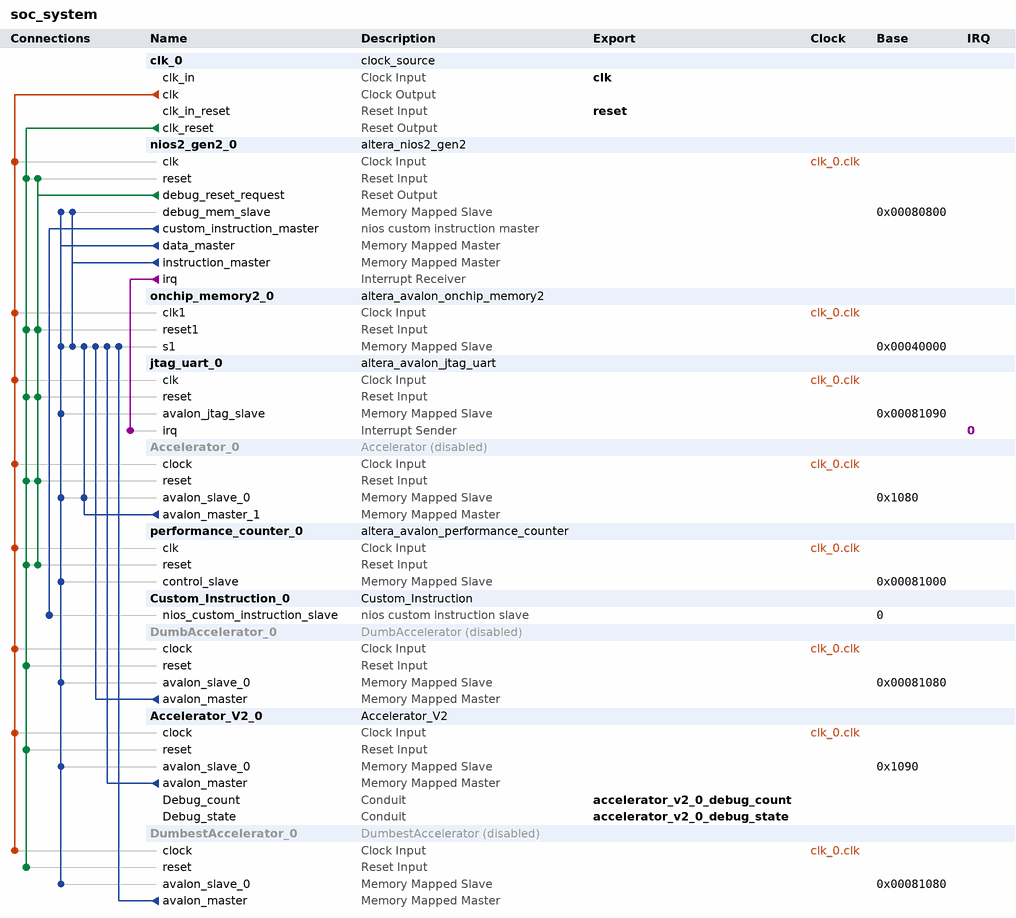
[diagram p0: system contents]
# Platform Designer (Qsys) system soc_system, Cyclone V 5CSEMA5F31C6
# Parameters at their usual value, and those the tool derives, are not listed.
package require -exact qsys 18.1
create_system soc_system
set_project_property DEVICE_FAMILY {Cyclone V}
set_project_property DEVICE 5CSEMA5F31C6

add_instance clk_0 clock_source 18.1
set_instance_parameter_value clk_0 clockFrequency 50000000

add_instance nios2_gen2_0 altera_nios2_gen2 18.1
set_instance_parameter_value nios2_gen2_0 dcache_size 2048
set_instance_parameter_value nios2_gen2_0 exceptionSlave onchip_memory2_0.s1
set_instance_parameter_value nios2_gen2_0 icache_size 4096
set_instance_parameter_value nios2_gen2_0 impl Fast
set_instance_parameter_value nios2_gen2_0 resetSlave onchip_memory2_0.s1

add_instance onchip_memory2_0 altera_avalon_onchip_memory2 18.1
set_instance_parameter_value onchip_memory2_0 dataWidth 32
set_instance_parameter_value onchip_memory2_0 dualPort false
set_instance_parameter_value onchip_memory2_0 initMemContent true
set_instance_parameter_value onchip_memory2_0 initializationFileName onchip_mem.hex
set_instance_parameter_value onchip_memory2_0 memorySize 262144

add_instance jtag_uart_0 altera_avalon_jtag_uart 18.1
set_instance_parameter_value jtag_uart_0 simInteractiveOptions NO_INTERACTIVE_WINDOWS

add_instance Accelerator_0 Accelerator 1.0
set_instance_property Accelerator_0 ENABLED false

add_instance performance_counter_0 altera_avalon_performance_counter 18.1
set_instance_parameter_value performance_counter_0 numberOfSections 7

add_instance Custom_Instruction_0 Custom_Instruction 1.0

add_instance DumbAccelerator_0 DumbAccelerator 1.0
set_instance_property DumbAccelerator_0 ENABLED false

add_instance Accelerator_V2_0 Accelerator_V2 1.0

add_instance DumbestAccelerator_0 DumbestAccelerator 1.0
set_instance_property DumbestAccelerator_0 ENABLED false

# connections
add_connection clk_0.clk Accelerator_0.clock clock
add_connection clk_0.clk Accelerator_V2_0.clock clock
add_connection clk_0.clk Accelerator_V2_0.clock clock
add_connection clk_0.clk DumbAccelerator_0.clock clock
add_connection clk_0.clk DumbestAccelerator_0.clock clock
add_connection clk_0.clk jtag_uart_0.clk clock
add_connection clk_0.clk nios2_gen2_0.clk clock
add_connection clk_0.clk onchip_memory2_0.clk1 clock
add_connection clk_0.clk performance_counter_0.clk clock
add_connection clk_0.clk_reset Accelerator_0.reset reset
add_connection clk_0.clk_reset Accelerator_V2_0.reset reset
add_connection clk_0.clk_reset Accelerator_V2_0.reset reset
add_connection clk_0.clk_reset DumbAccelerator_0.reset reset
add_connection clk_0.clk_reset DumbestAccelerator_0.reset reset
add_connection clk_0.clk_reset jtag_uart_0.reset reset
add_connection clk_0.clk_reset nios2_gen2_0.reset reset
add_connection clk_0.clk_reset onchip_memory2_0.reset1 reset
add_connection clk_0.clk_reset performance_counter_0.reset reset
add_connection nios2_gen2_0.debug_reset_request Accelerator_0.reset reset
add_connection nios2_gen2_0.debug_reset_request jtag_uart_0.reset reset
add_connection nios2_gen2_0.debug_reset_request nios2_gen2_0.reset reset
add_connection nios2_gen2_0.debug_reset_request onchip_memory2_0.reset1 reset
add_connection nios2_gen2_0.debug_reset_request performance_counter_0.reset reset
add_connection Accelerator_0.avalon_master_1 Accelerator_0.avalon_slave_0 avalon
set_connection_parameter_value Accelerator_0.avalon_master_1/Accelerator_0.avalon_slave_0 baseAddress 0x1080
add_connection Accelerator_0.avalon_master_1 onchip_memory2_0.s1 avalon
set_connection_parameter_value Accelerator_0.avalon_master_1/onchip_memory2_0.s1 baseAddress 0x00040000
add_connection Accelerator_V2_0.avalon_master onchip_memory2_0.s1 avalon
set_connection_parameter_value Accelerator_V2_0.avalon_master/onchip_memory2_0.s1 baseAddress 0x00040000
add_connection Accelerator_V2_0.avalon_master onchip_memory2_0.s1 avalon
set_connection_parameter_value Accelerator_V2_0.avalon_master/onchip_memory2_0.s1 baseAddress 0x00040000
add_connection DumbAccelerator_0.avalon_master onchip_memory2_0.s1 avalon
set_connection_parameter_value DumbAccelerator_0.avalon_master/onchip_memory2_0.s1 baseAddress 0x00040000
add_connection DumbestAccelerator_0.avalon_master onchip_memory2_0.s1 avalon
set_connection_parameter_value DumbestAccelerator_0.avalon_master/onchip_memory2_0.s1 baseAddress 0x00040000
add_connection nios2_gen2_0.data_master Accelerator_0.avalon_slave_0 avalon
set_connection_parameter_value nios2_gen2_0.data_master/Accelerator_0.avalon_slave_0 baseAddress 0x1080
add_connection nios2_gen2_0.data_master Accelerator_V2_0.avalon_slave_0 avalon
set_connection_parameter_value nios2_gen2_0.data_master/Accelerator_V2_0.avalon_slave_0 baseAddress 0x1090
add_connection nios2_gen2_0.data_master Accelerator_V2_0.avalon_slave_0 avalon
set_connection_parameter_value nios2_gen2_0.data_master/Accelerator_V2_0.avalon_slave_0 baseAddress 0x1090
add_connection nios2_gen2_0.data_master DumbAccelerator_0.avalon_slave_0 avalon
set_connection_parameter_value nios2_gen2_0.data_master/DumbAccelerator_0.avalon_slave_0 baseAddress 0x00081080
add_connection nios2_gen2_0.data_master DumbestAccelerator_0.avalon_slave_0 avalon
set_connection_parameter_value nios2_gen2_0.data_master/DumbestAccelerator_0.avalon_slave_0 baseAddress 0x00081080
add_connection nios2_gen2_0.data_master jtag_uart_0.avalon_jtag_slave avalon
set_connection_parameter_value nios2_gen2_0.data_master/jtag_uart_0.avalon_jtag_slave baseAddress 0x00081090
add_connection nios2_gen2_0.data_master nios2_gen2_0.debug_mem_slave avalon
set_connection_parameter_value nios2_gen2_0.data_master/nios2_gen2_0.debug_mem_slave baseAddress 0x00080800
add_connection nios2_gen2_0.data_master onchip_memory2_0.s1 avalon
set_connection_parameter_value nios2_gen2_0.data_master/onchip_memory2_0.s1 baseAddress 0x00040000
add_connection nios2_gen2_0.data_master performance_counter_0.control_slave avalon
set_connection_parameter_value nios2_gen2_0.data_master/performance_counter_0.control_slave baseAddress 0x00081000
add_connection nios2_gen2_0.instruction_master nios2_gen2_0.debug_mem_slave avalon
set_connection_parameter_value nios2_gen2_0.instruction_master/nios2_gen2_0.debug_mem_slave baseAddress 0x00080800
add_connection nios2_gen2_0.instruction_master onchip_memory2_0.s1 avalon
set_connection_parameter_value nios2_gen2_0.instruction_master/onchip_memory2_0.s1 baseAddress 0x00040000
add_connection nios2_gen2_0.irq jtag_uart_0.irq interrupt
set_connection_parameter_value nios2_gen2_0.irq/jtag_uart_0.irq irqNumber 0
add_connection nios2_gen2_0.custom_instruction_master Custom_Instruction_0.nios_custom_instruction_slave nios_custom_instruction
set_connection_parameter_value nios2_gen2_0.custom_instruction_master/Custom_Instruction_0.nios_custom_instruction_slave CIName custom_instruction_0
set_connection_parameter_value nios2_gen2_0.custom_instruction_master/Custom_Instruction_0.nios_custom_instruction_slave baseAddress 0

# exported interfaces
add_interface accelerator_v2_0_debug_count conduit end
set_interface_property accelerator_v2_0_debug_count EXPORT_OF Accelerator_V2_0.Debug_count
add_interface accelerator_v2_0_debug_state conduit end
set_interface_property accelerator_v2_0_debug_state EXPORT_OF Accelerator_V2_0.Debug_state
add_interface clk clock sink
set_interface_property clk EXPORT_OF clk_0.clk_in
add_interface reset reset sink
set_interface_property reset EXPORT_OF clk_0.clk_in_reset

set_interconnect_requirement {$system} qsys_mm.clockCrossingAdapter HANDSHAKE
set_interconnect_requirement {$system} qsys_mm.enableEccProtection FALSE
set_interconnect_requirement {$system} qsys_mm.insertDefaultSlave FALSE
set_interconnect_requirement {$system} qsys_mm.maxAdditionalLatency 1

save_system soc_system.qsys
